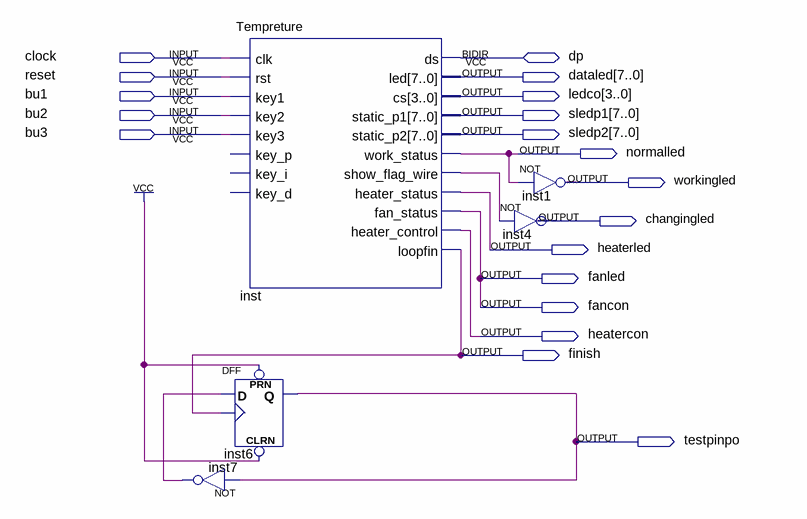
[diagram p0: schematic sheet]
// Quartus schematic test.bdf as structural Verilog: 5 symbols, 19 pins
module test (
  input  clock,
  input  reset,
  input  bu1,
  input  bu2,
  input  bu3,
  inout  dp,
  output [7:0] dataled,
  output [3:0] ledco,
  output [7:0] sledp1,
  output [7:0] sledp2,
  output normalled,
  output workingled,
  output changingled,
  output heaterled,
  output fanled,
  output fancon,
  output heatercon,
  output finish,
  output testpinpo
);

  wire inst7_out, inst_show_flag_wire;

  DFF inst6 (.CLRN(1'b1), .CLK(finish), .D(inst7_out), .PRN(1'b1), .Q(testpinpo));
  not inst7 (inst7_out, testpinpo);
  Tempreture inst (
    .clk(clock), .rst(reset), .key1(bu1), .key2(bu2), .key3(bu3), .led(dataled), .cs(ledco),
    .static_p1(sledp1), .static_p2(sledp2), .work_status(normalled), .show_flag_wire(inst_show_flag_wire),
    .heater_status(heaterled), .fan_status(fancon), .heater_control(heatercon), .loopfin(finish), .ds(dp));  // open: key_p, key_i, key_d
  not inst1 (workingled, normalled);
  not inst4 (changingled, inst_show_flag_wire);

  assign fanled = fancon;
endmodule
